# Altium schematic sheet Sheet1.SchDoc
size A4; SheetNumber: 1; SheetTotal: 1
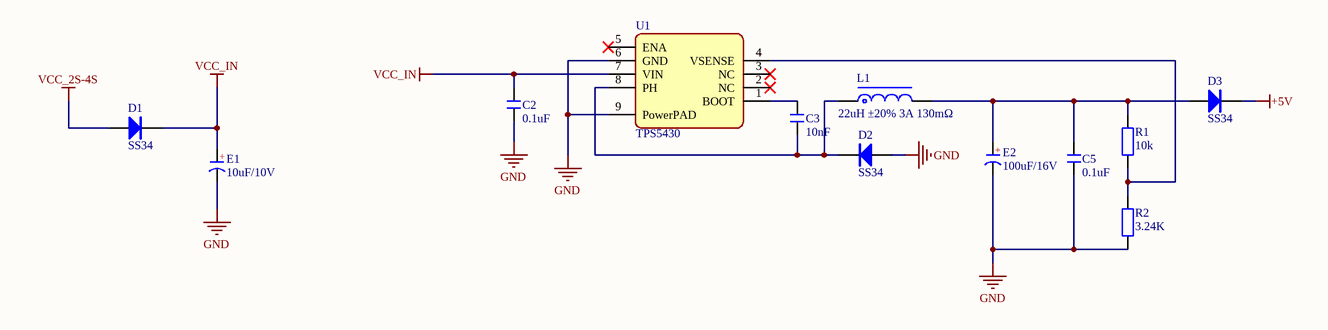
[diagram p0: Sheet1.SchDoc]

## Parts
C2  0.1uF  [C 0805_L]
C3  10nF  [C 0805_L]
C5  0.1uF  [C 0805_L]
D1  SS34  [SMC]
D2  SS34  [SMC]
D3  SS34  [SMC]
E1  10uF/10V  [CT 10*8 - R]
E2  100uF/16V  [CD B(3528)]
L1  22uH ±20% 3A 130mΩ  [22uH ±20% 3A 130mΩ]
R1  10k  [R 0805_L]
R2  3.24K  [R 0805_L]
U1  TPS5430  [TPS5430]

## Nets
+5V: D3.2(K)
GND: C2.1 C5.1 D2.1(A) E1.2(K) E2.2(K) R2.1 U1.6(GND) U1.9(PowerPAD)
VCC_2S-4S: D1.1(A)
VCC_IN: C2.2 D1.2(K) E1.1(A) U1.7(VIN)
NetC3_1: C3.1 D2.2(K) L1.1 U1.8(PH)
NetC3_2: C3.2 U1.1(BOOT)
NetC5_2: C5.2 D3.1(A) E2.1(A) L1.2 R1.2
NetR1_1: R1.1 R2.2 U1.4(VSENSE)

Not connected (* = marked no-connect by the designer): U1 2(NC)* 3(NC)* 5(ENA)*

## Notes on the sheet
- (in symbol C-CD) +
- (in symbol C-CT) +

## Library data of the parts
C2 C3 C5 = C: 无极性贴片电容; 版权归属: 源创客; BOM名称: 无极性贴片电容; 学习资源: www.ooocke.com
D1-D3 = SS34: 肖特基二极管; 版权归属: 源创客; 属性: 40V/3A; BOM名称: 肖特基二极管; 学习资源: www.ooocke.com
E1 = C-CT: 贴片固态电容; 版权归属: 源创客; BOM名称: 贴片固态电容; 学习资源: www.ooocke.com
E2 = C-CD: 贴片钽电容; 版权归属: 源创客; BOM名称: 贴片钽电容; 学习资源: www.ooocke.com
L1 = L-CD: 贴片功率电感; BOM名称: 功率电感; 版权归属: 源创客; 学习资源: www.ooocke.com
R1 R2 = R: 贴片电阻; 版权归属: 源创客; BOM名称: 贴片电阻; 学习资源: www.ooocke.com
U1 = TPS5430: LC_C9864